# EAGLE design CanarySchematic3.0 (EAGLE 8.4.1)
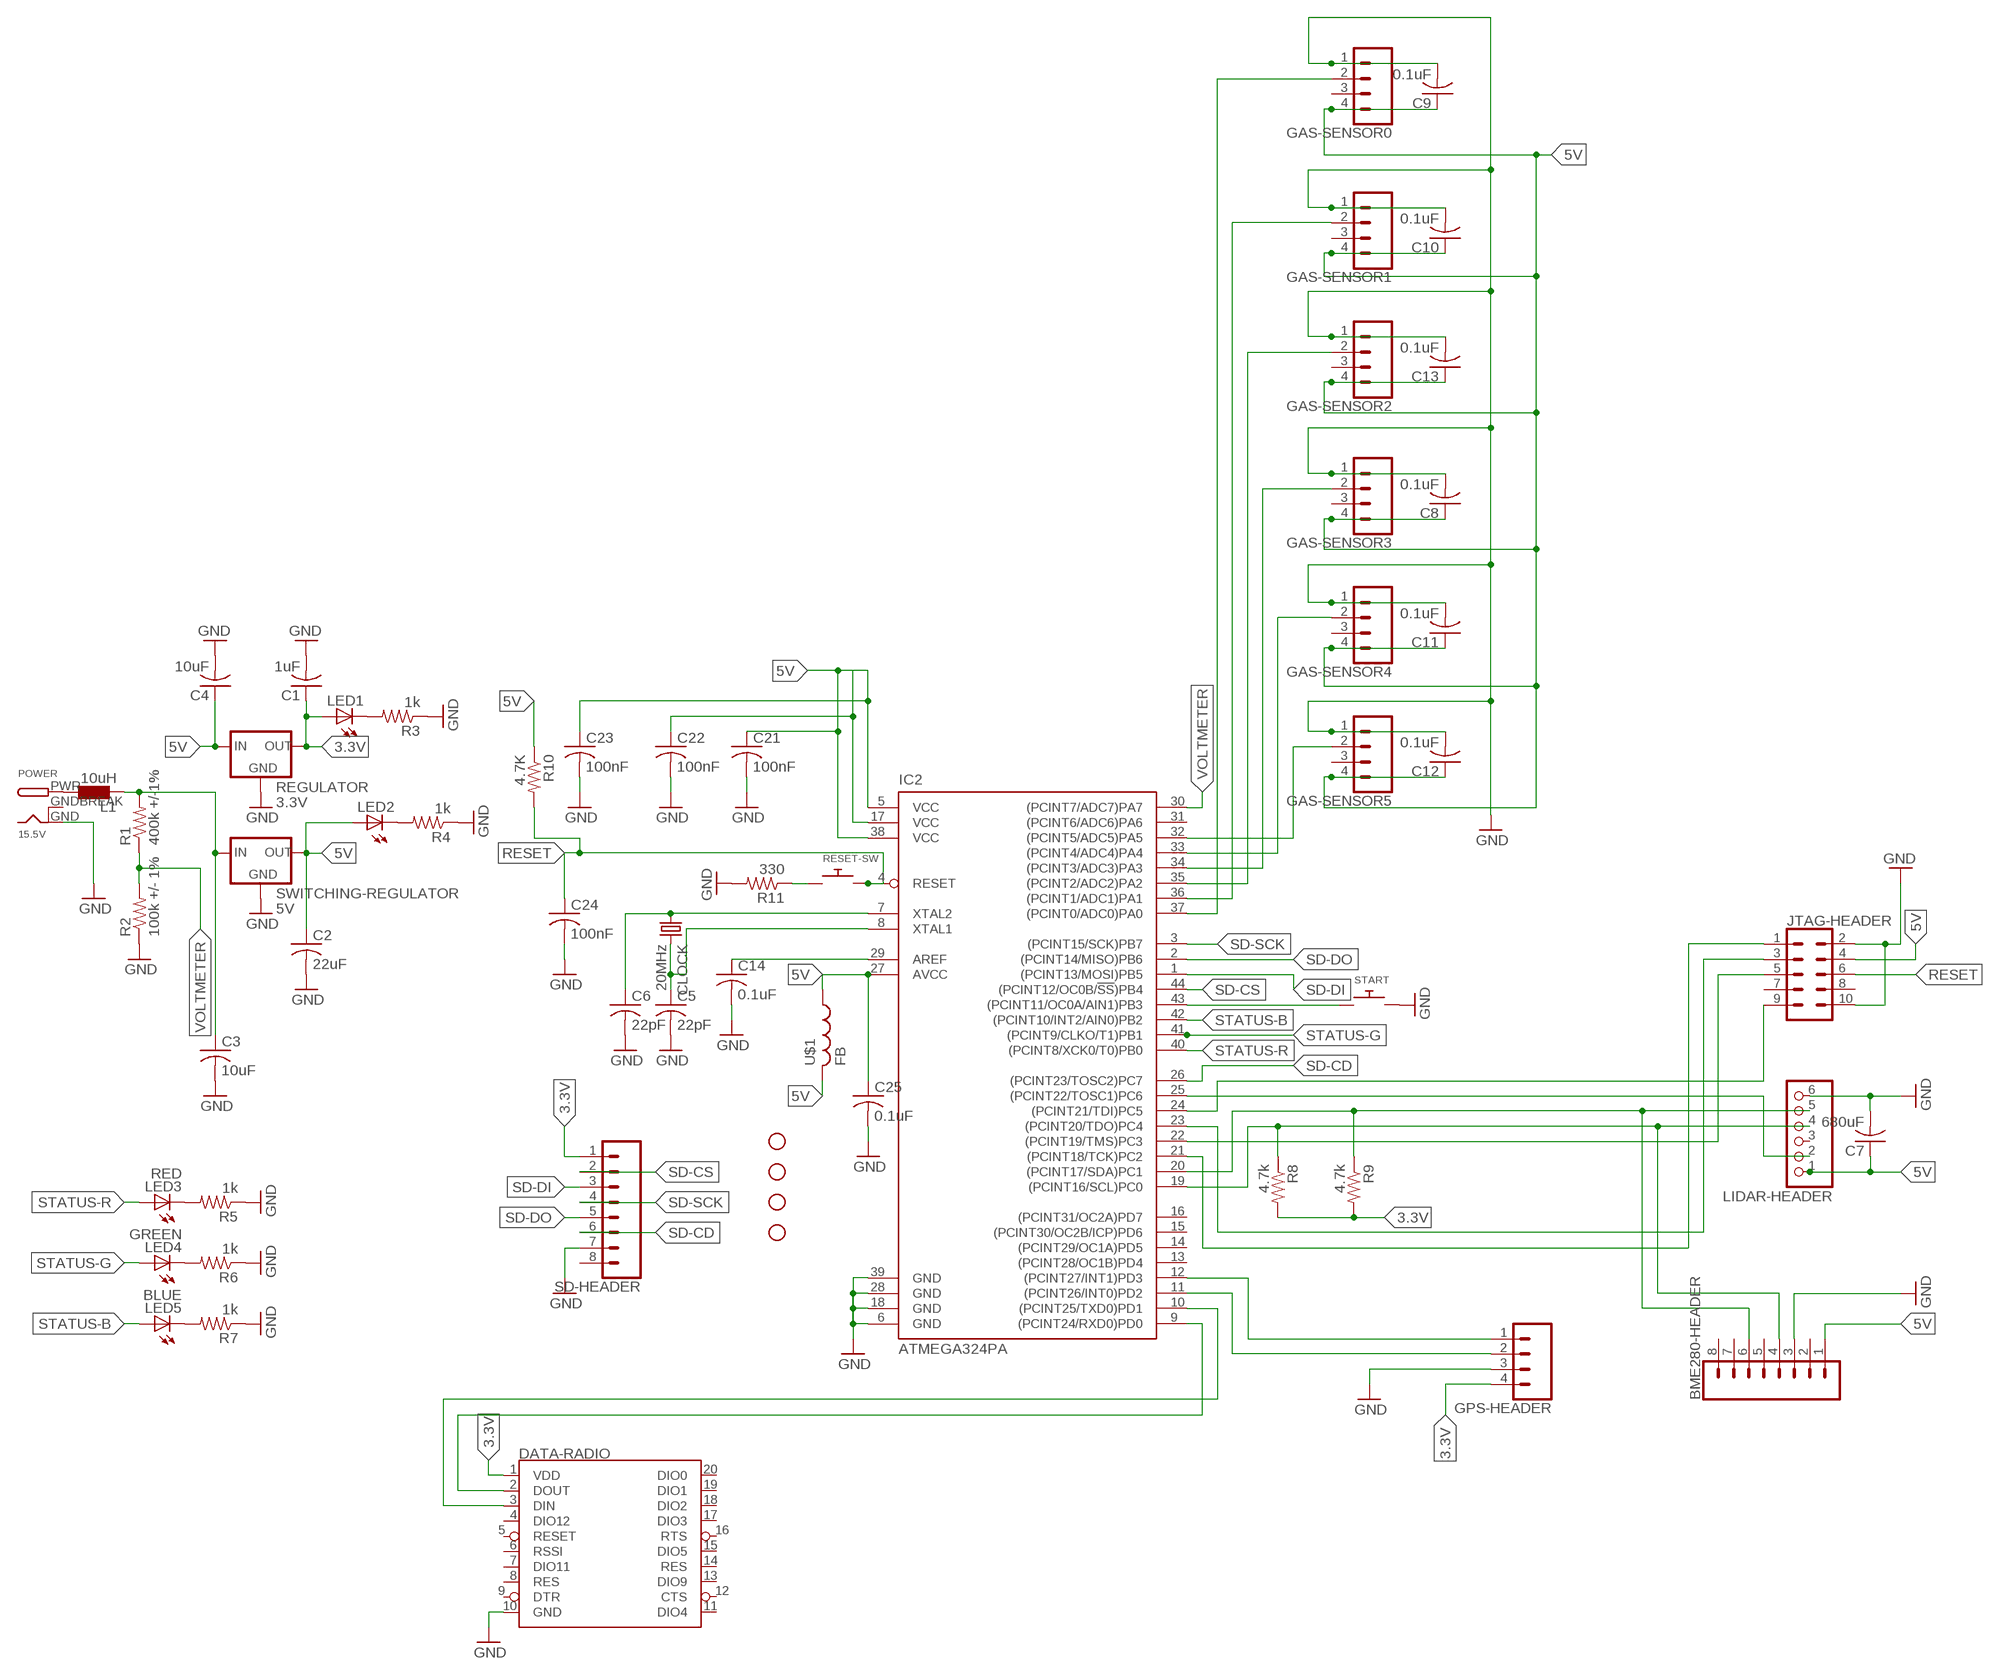
[diagram p0: schematic, sheet 1]

## Parts
BME280-HEADER  CONN_08"  [1X08]
C1  1uF  C-USC0805  [C0805]
C2  22uF  C-USC0805  [C0805]
C3  10uF  C-USC0805  [C0805]
C4  10uF  C-USC0805  [C0805]
C5  22pF  C-USC0805  [C0805]
C6  22pF  C-USC0805  [C0805]
C7  680uF  C-USC0805  [C0805]
C8  0.1uF  C-USC0805  [C0805]
C9  0.1uF  C-USC0805  [C0805]
C10  0.1uF  C-USC0805  [C0805]
C11  0.1uF  C-USC0805  [C0805]
C12  0.1uF  C-USC0603  [C0603]
C13  0.1uF  C-USC0805  [C0805]
C14  0.1uF  C-USC0805  [C0805]
C21  100nF  C-USC0805  [C0805]
C22  100nF  C-USC0805  [C0805]
C23  100nF  C-USC0805  [C0805]
C24  100nF  C-USC0805  [C0805]
C25  0.1uF  C-USC0805  [C0805]
CLOCK  20MHz  CRYSTAL68SMX  [86SMX]
DATA-RADIO  XBEE  [XBEE]
GAS-SENSOR0  CONN_04  [1X04]
GAS-SENSOR1  CONN_04  [1X04]
GAS-SENSOR2  CONN_04  [1X04]
GAS-SENSOR3  CONN_04  [1X04]
GAS-SENSOR4  CONN_04  [1X04]
GAS-SENSOR5  CONN_04  [1X04]
GPS-HEADER  CONN_04  [1X04]
H8  STAND-OFF  [STAND-OFF]
IC2  ATMEGA324PA  ATMEGA644A  [TQFP44]
JTAG-HEADER  CONN_05X2PTH  [2X5]
L1  10uH  L  [L1812]
LED1  LEDCHIP-LED0805  [CHIP-LED0805]
LED2  LEDCHIP-LED0805  [CHIP-LED0805]
LED3  RED  LEDCHIP-LED0805  [CHIP-LED0805]
LED4  GREEN  LEDCHIP-LED0805  [CHIP-LED0805]
LED5  BLUE  LEDCHIP-LED0805  [CHIP-LED0805]
LIDAR-HEADER  PINHD-1X6  [1X06]
MOUNT-HOLE1  STAND-OFF  [STAND-OFF]
MOUNT-HOLE2  STAND-OFF  [STAND-OFF]
MOUNT-HOLE3  STAND-OFF  [STAND-OFF]
POWER  15.5V  DCBARRELPTH  [DCJACK_2MM_PTH]
R1  400k +/-1%  R-US_M0805  [M0805]
R2  100k +/- 1%  R-US_M0805  [M0805]
R3  1k  R-US_M0805  [M0805]
R4  1k  R-US_M0805  [M0805]
R5  1k  R-US_M0805  [M0805]
R6  1k  R-US_M0805  [M0805]
R7  1k  R-US_M0805  [M0805]
R8  4.7k  R-US_M0805  [M0805]
R9  4.7k  R-US_M0805  [M0805]
R10  4.7K  R-US_M0805  [M0805]
R11  330  R-US_M0805  [M0805]
REGULATOR  3.3V  V_REG_78XXSINK  [TO220-IGO]
RESET-SW  SWITCH_PUSHBUTTONSOFTTOUCHSMD_SJ  [PUSHBUTTON_SMD_SJ]
SD-HEADER  CONN_08"  [1X08]
START  SWITCH_PUSHBUTTONSOFTTOUCHSMD_SJ  [PUSHBUTTON_SMD_SJ]
SWITCHING-REGULATOR  5V  V_REG_78XXSINK  [TO220-IGO]
U$1  FB  [FB]

## Nets
3.3V: C1.1 DATA-RADIO.1(VDD) GPS-HEADER.4 LED1.A R8.2 R9.2 REGULATOR.OUT SD-HEADER.1
5V: BME280-HEADER.1 C2.1 C4.1 C7.1 C8.1 C9.1 C10.1 C11.1 C12.1 C13.1 C21.1 C22.1 C23.1 C25.1 GAS-SENSOR0.4 GAS-SENSOR1.4 GAS-SENSOR2.4 GAS-SENSOR3.4 GAS-SENSOR4.4 GAS-SENSOR5.4 IC2.5(VCC) IC2.17(VCC) IC2.27(AVCC) IC2.38(VCC) JTAG-HEADER.4 LED2.A LIDAR-HEADER.1 REGULATOR.IN SWITCHING-REGULATOR.OUT U$1.P$1
GND: BME280-HEADER.3 C1.2 C2.2 C3.2 C4.2 C5.2 C6.2 C7.2 C8.2 C9.2 C10.2 C11.2 C12.2 C13.2 C14.2 C21.2 C22.2 C23.2 C24.2 C25.2 DATA-RADIO.10(GND) GAS-SENSOR0.1 GAS-SENSOR1.1 GAS-SENSOR2.1 GAS-SENSOR3.1 GAS-SENSOR4.1 GAS-SENSOR5.1 GPS-HEADER.3 IC2.6(GND) IC2.18(GND) IC2.28(GND) IC2.39(GND) JTAG-HEADER.2 JTAG-HEADER.10 LIDAR-HEADER.6 POWER.GND R2.1 R3.1 R4.1 R5.1 R6.1 R7.1 R11.2 REGULATOR.GND SD-HEADER.7 START.P$2 SWITCHING-REGULATOR.GND
N$1: C3.1 L1.2 R1.2 SWITCHING-REGULATOR.IN
N$2: LED1.C R3.2
N$3: LED2.C R4.2
N$4: LED3.C R5.2
N$5: LED4.C R6.2
N$6: LED5.C R7.2
N$7: IC2.43((PCINT11/OC0A/AIN1)PB3) START.P$1
N$8: C6.1 CLOCK.1 IC2.7(XTAL2)
N$9: U$1.P$2
N$10: GPS-HEADER.1 IC2.12((PCINT27/INT1)PD3)
N$11: GPS-HEADER.2 IC2.11((PCINT26/INT0)PD2)
N$12: GAS-SENSOR0.2 IC2.37((PCINT0/ADC0)PA0)
N$13: IC2.25((PCINT22/TOSC1)PC6) LIDAR-HEADER.2
N$14: IC2.24((PCINT21/TDI)PC5) JTAG-HEADER.9
N$15: C14.1 IC2.29(AREF)
N$16: GAS-SENSOR1.2 IC2.36((PCINT1/ADC1)PA1)
N$17: GAS-SENSOR2.2 IC2.35((PCINT2/ADC2)PA2)
N$18: GAS-SENSOR3.2 IC2.34((PCINT3/ADC3)PA3)
N$19: GAS-SENSOR4.2 IC2.33((PCINT4/ADC4)PA4)
N$20: GAS-SENSOR5.2 IC2.32((PCINT5/ADC5)PA5)
N$21: BME280-HEADER.4 IC2.19((PCINT16/SCL)PC0) LIDAR-HEADER.4 R8.1
N$22: L1.1 POWER.PWR
N$23: IC2.23((PCINT20/TDO)PC4) JTAG-HEADER.3
N$24: BME280-HEADER.6 IC2.20((PCINT17/SDA)PC1) LIDAR-HEADER.5 R9.1
N$25: IC2.22((PCINT19/TMS)PC3) JTAG-HEADER.5
N$26: DATA-RADIO.3(DIN) IC2.10((PCINT25/TXD0)PD1)
N$27: DATA-RADIO.2(DOUT) IC2.9((PCINT24/RXD0)PD0)
N$28: IC2.21((PCINT18/TCK)PC2) JTAG-HEADER.1
N$30: R11.1 RESET-SW.P$1
N$31: R10.1
N$32: C5.1 CLOCK.4 IC2.8(XTAL1)
RESET: C24.1 IC2.4(RESET) JTAG-HEADER.6 R10.2 RESET-SW.P$2
SD-CD: IC2.26((PCINT23/TOSC2)PC7) SD-HEADER.6
SD-CS: IC2.44((PCINT12/OC0B/!SS!)PB4) SD-HEADER.2
SD-DI: IC2.1((PCINT13/MOSI)PB5) SD-HEADER.3
SD-DO: IC2.2((PCINT14/MISO)PB6) SD-HEADER.5
SD-SCK: IC2.3((PCINT15/SCK)PB7) SD-HEADER.4
STATUS-B: IC2.42((PCINT10/INT2/AIN0)PB2) LED5.A
STATUS-G: IC2.41((PCINT9/CLKO/T1)PB1) LED4.A
STATUS-R: IC2.40((PCINT8/XCK0/T0)PB0) LED3.A
VOLTMETER: IC2.30((PCINT7/ADC7)PA7) R1.1 R2.2
Unconnected: BME280-HEADER.2 BME280-HEADER.5 BME280-HEADER.7 BME280-HEADER.8 DATA-RADIO.4(DIO12) DATA-RADIO.5(RESET) DATA-RADIO.6(RSSI) DATA-RADIO.7(DIO11) DATA-RADIO.8(RES) DATA-RADIO.9(DTR) DATA-RADIO.11(DIO4) DATA-RADIO.12(CTS) DATA-RADIO.13(DIO9) DATA-RADIO.14(RES) DATA-RADIO.15(DIO5) DATA-RADIO.16(RTS) DATA-RADIO.17(DIO3) DATA-RADIO.18(DIO2) DATA-RADIO.19(DIO1) DATA-RADIO.20(DIO0) GAS-SENSOR0.3 GAS-SENSOR1.3 GAS-SENSOR2.3 GAS-SENSOR3.3 GAS-SENSOR4.3 GAS-SENSOR5.3 IC2.13((PCINT28/OC1B)PD4) IC2.14((PCINT29/OC1A)PD5) IC2.15((PCINT30/OC2B/ICP)PD6) IC2.16((PCINT31/OC2A)PD7) IC2.31((PCINT6/ADC6)PA6) JTAG-HEADER.7 JTAG-HEADER.8 LIDAR-HEADER.3 SD-HEADER.8

## Power pins joined to a net without a drawn wire
GNDBREAK: POWER.GNDBREAK

## Library data of the parts
BME280-HEADER SD-HEADER = SparkFun-Connectors:CONN_08: Multi connection point. Often used as Generic Header-pin footprint for 0.1 inch spaced/style header connections On any of the 0.1 inch spaced packages, you can populate with these: Break Away Headers - Straight <https://www.sparkfun.com/products/116> (PRT-00116) Break Away Male Headers - Right Angle <https://www.sparkfun.com/products/553> (PRT-00553) Female Headers <https://www.sparkfun.com/products/115> (PRT-00115) Break Away Headers - Machine Pin <https://www.sparkfun.com/products/117> (PRT-00117) Break Away Female Headers - Swiss Machine Pin <https://www.sparkfun.com/products/743> (PRT-00743) Arduino Stackable Header - 8 Pin <https://www.sparkfun.com/products/9279> (PRT-09279) For SCREWTERMINALS and SPRING TERMINALS visit here: Screw Terimnals on SparkFun.com <https://www.sparkfun.com/search/results?term=Screw+Terminals> (5mm/3.5mm/2.54mm spacing) This device is also useful as a general connection point to wire up your design to another part of your project. Our various solder wires solder well into these plated through hole pads. Hook-Up Wire - Assortment (Stranded, 22 AWG) <https://www.sparkfun.com/products/11375> (PRT-11375) Hook-Up Wire - Assortment (Solid Core, 22 AWG) <https://www.sparkfun.com/products/11367> (PRT-11367) View the entire wire category on our website here <https://www.sparkfun.com/categories/141> Special notes: Molex polarized connector foot print use with SKU : PRT-08231 with associated crimp pins and housings. 1MM SMD Version SKU: PRT-10208 NOTES ON THE VARIANTS LOCK and LOCK_LONGPADS... This footprint was designed to help hold the alignment of a through-hole component (i.e. 6-pin header) while soldering it into place. You may notice that each hole has been shifted either up or down by 0.005 of an inch from it's more standard position (which is a perfectly straight line). This slight alteration caused the pins (the squares in the middle) to touch the edges of the holes. Because they are alternating, it causes a "brace" to hold the component in place. 0.005 has proven to be the perfect amount of "off-center" position when using our standard breakaway headers. Although looks a little odd when you look at the bare footprint, once you have a header in there, the alteration is very hard to notice. Also,if you push a header all the way into place, it is covered up entirely on the bottom side.; PROD_ID: CONN-08438
C1-C14 C21-C25 = adafruit:C-US: CAPACITOR, American symbol
CLOCK = adafruit:CRYSTAL: CRYSTAL; OC_FARNELL: 6344860; OC_NEWARK: unknown
DATA-RADIO = SparkFun-RF:XBEE: Digi XBee and XBee Pro XBees are tiny blue chips that can communicate wirelessly with each other. They can do simple things, like replacing a couple of wires in serial communication, which is nice when you want to make a remote for your paintball vehicle. SparkFun Products SparkFun XBee Buying Guide <https://www.sparkfun.com/pages/xbee_guide> SparkFun XBee Explorer USB <https://www.sparkfun.com/products/11812> (WRL-11812) Breakout Board for XBee Module <https://www.sparkfun.com/products/8276> (WRL-8276) SparkFun XBee Explorer Regulated <https://www.sparkfun.com/products/11373> (WRL-11373) SparkFun XBee Explorer Dongle <https://www.sparkfun.com/products/11697> (WRL-11697) SparkFun XBee Shield <https://www.sparkfun.com/products/12847> (WRL-12847) SparkFun XBee Explorer Serial <https://www.sparkfun.com/products/13225> (WRL-13225)
GAS-SENSOR0 GAS-SENSOR1-GAS-SENSOR5 GPS-HEADER = SparkFun-Connectors:CONN_04: Multi connection point. Often used as Generic Header-pin footprint for 0.1 inch spaced/style header connections On any of the 0.1 inch spaced packages, you can populate with these: Break Away Headers - Straight <https://www.sparkfun.com/products/116> (PRT-00116) Break Away Male Headers - Right Angle <https://www.sparkfun.com/products/553> (PRT-00553) Female Headers <https://www.sparkfun.com/products/115> (PRT-00115) Break Away Headers - Machine Pin <https://www.sparkfun.com/products/117> (PRT-00117) Break Away Female Headers - Swiss Machine Pin <https://www.sparkfun.com/products/743> (PRT-00743) For SCREWTERMINALS and SPRING TERMINALS visit here: Screw Terimnals on SparkFun.com <https://www.sparkfun.com/search/results?term=Screw+Terminals> (5mm/3.5mm/2.54mm spacing) This device is also useful as a general connection point to wire up your design to another part of your project. Our various solder wires solder well into these plated through hole pads. Hook-Up Wire - Assortment (Stranded, 22 AWG) <https://www.sparkfun.com/products/11375> (PRT-11375) Hook-Up Wire - Assortment (Solid Core, 22 AWG) <https://www.sparkfun.com/products/11367> (PRT-11367) View the entire wire category on our website here <https://www.sparkfun.com/categories/141> Special notes: Molex polarized connector foot print use with SKU : PRT-08231 with associated crimp pins and housings. 1MM SMD Version SKU: PRT-10208; PROD_ID: CONN-09696
H8 MOUNT-HOLE1-MOUNT-HOLE3 = SparkFun-Hardware:STAND-OFF: Stand Off Drill holes for mechanically mounting via screws, standoffs, etc. Note: Use the keepout ring to avoid running the screw head into surrounding components. Variant Overviews STAND-OFF - Mechanical footprint for a #4 phillips button head screw. STAND-OFF-TIGHT - Mechanical footprint for a #4 phillips button head screw, Example SparkFun Products Screw - Phillips Head (1/4", 4-40, 10 pack) <https://www.sparkfun.com/products/10453> (PRT-10453) Screw - Phillips Head (1/2", 4-40, 10 pack) <https://www.sparkfun.com/products/10452> (PRT-10452) Screw - Phillips Head (3/4", 4-40, 10 pack) <https://www.sparkfun.com/products/10451> (PRT-10451) Screw - Phillips Head (1", 4-40, 10 pack) <https://www.sparkfun.com/products/10450> (PRT-10450)
IC2 = atmel:ATMEGA644: 8-bit Microcontroller with 64K Bytes In-System Programmable Flash Source: http://www.atmel.com/dyn/resources/prod_documents/doc2593.pdf; MPN: ATMEGA644PV-10AU; OC_FARNELL: 1455123; OC_NEWARK: 58M3748
JTAG-HEADER = SparkFun-Connectors:CONN_05X2: Multi connection point. Often used as Generic Header-pin footprint for 0.1 inch spaced/style header connections For AVR SPI programming port, see special device with nice symbol: "AVR_SPI_PROG_5x2.dev" You can populate with any combo of single row headers, but if you'd like an exact match, check these: 2x5 AVR ICSP Male Header <https://www.sparkfun.com/products/778> (PRT-00778) 2x5 Pin Shrouded Header <https://www.sparkfun.com/products/8506> (PRT-08506) On any of the 0.1 inch spaced packages, you can populate with these: Break Away Headers - Straight <https://www.sparkfun.com/products/116> (PRT-00116) Break Away Male Headers - Right Angle <https://www.sparkfun.com/products/553> (PRT-00553) Female Headers <https://www.sparkfun.com/products/115> (PRT-00115) Break Away Headers - Machine Pin <https://www.sparkfun.com/products/117> (PRT-00117) Break Away Female Headers - Swiss Machine Pin <https://www.sparkfun.com/products/743> (PRT-00743) Special note: the shrouded connector mates well with our 5x2 ribbon cables: 2x5 Pin IDC Ribbon Cable <https://www.sparkfun.com/products/8535> (PRT-08535); PROD_ID: CONN-08499; SF_ID: PRT-0778
L1 = eagle-ltspice:L: INDUCTOR, European symbol; SPICEMODEL: NONE; SPICEPREFIX: L
LED1-LED5 = adafruit:LED: LED OSRAM: - CHIPLED LG R971, LG N971, LY N971, LG Q971, LY Q971, LO R971, LY R971 LH N974, LH R974 LS Q976, LO Q976, LY Q976 LO Q996 - Hyper CHIPLED LW Q18S LB Q993, LB Q99A, LB R99A - SideLED LS A670, LO A670, LY A670, LG A670, LP A670 LB A673, LV A673, LT A673, LW A673 LH A674 LY A675 LS A676, LA A676, LO A676, LY A676, LW A676 LS A679, LY A679, LG A679 - Hyper Micro SIDELED® LS Y876, LA Y876, LO Y876, LY Y876 LT Y87S - SmartLED LW L88C, LW L88S LB L89C, LB L89S, LG L890 LS L89K, LO L89K, LY L89K LS L896, LA L896, LO L896, LY L896 - TOPLED LS T670, LO T670, LY T670, LG T670, LP T670 LSG T670, LSP T670, LSY T670, LOP T670, LYG T670 LG T671, LOG T671, LSG T671 LB T673, LV T673, LT T673, LW T673 LH T674 LS T676, LA T676, LO T676, LY T676, LB T676, LH T676, LSB T676, LW T676 LB T67C, LV T67C, LT T67C, LS T67K, LO T67K, LY T67K, LW E67C LS E67B, LA E67B, LO E67B, LY E67B, LB E67C, LV E67C, LT E67C LW T67C LS T679, LY T679, LG T679 LS T770, LO T770, LY T770, LG T770, LP T770 LB T773, LV T773, LT T773, LW T773 LH T774 LS E675, LA E675, LY E675, LS T675 LS T776, LA T776, LO T776, LY T776, LB T776 LHGB T686 LT T68C, LB T68C - Hyper Mini TOPLED® LB M676 - Mini TOPLED Santana® LG M470 LS M47K, LO M47K, LY M47K Source: http://www.osram.convergy.de/
LIDAR-HEADER = adafruit:PINHD-1X6: PIN HEADER
POWER = adafruit:DCBARREL: 2.0mm DC Barrel Jack DCJACK_2MM_PTH - Through Hole Jack (4UConnector: 05537)
R1-R11 = adafruit:R-US_: RESISTOR, American symbol
REGULATOR SWITCHING-REGULATOR = SparkFun-IC-Power:V_REG_78XX: Voltage Regulator Standard 78xx regulator. IGO (Input Ground Output). Spark Fun Electronics SKU : COM-00107
RESET-SW START = adafruit:SWITCH_PUSHBUTTON: Buttons SOFTTOUCHSMD_SJ - Soft touch temporary push button (Super Junk Akihabara) Compatible with SKPMANE010 [Mouser: 688-SKPMAN] C&K_KSS = Digikey: KSS221GLFS
U$1 = adafruit:FB: Ferrite bead Digikey #P9821BK-ND

## Board
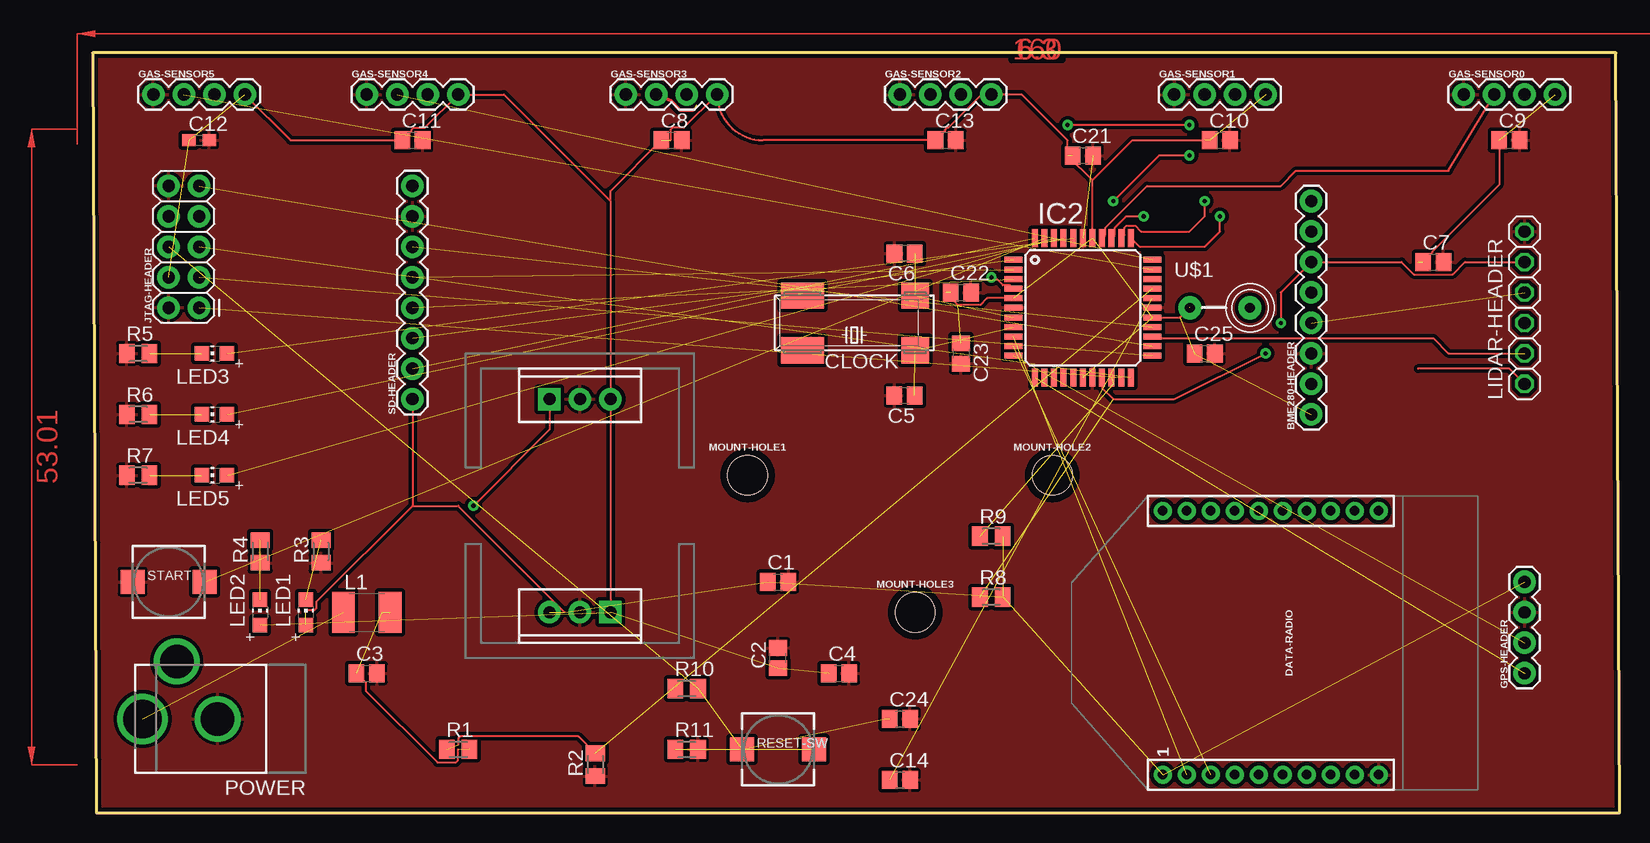
[diagram p1: board, top side]
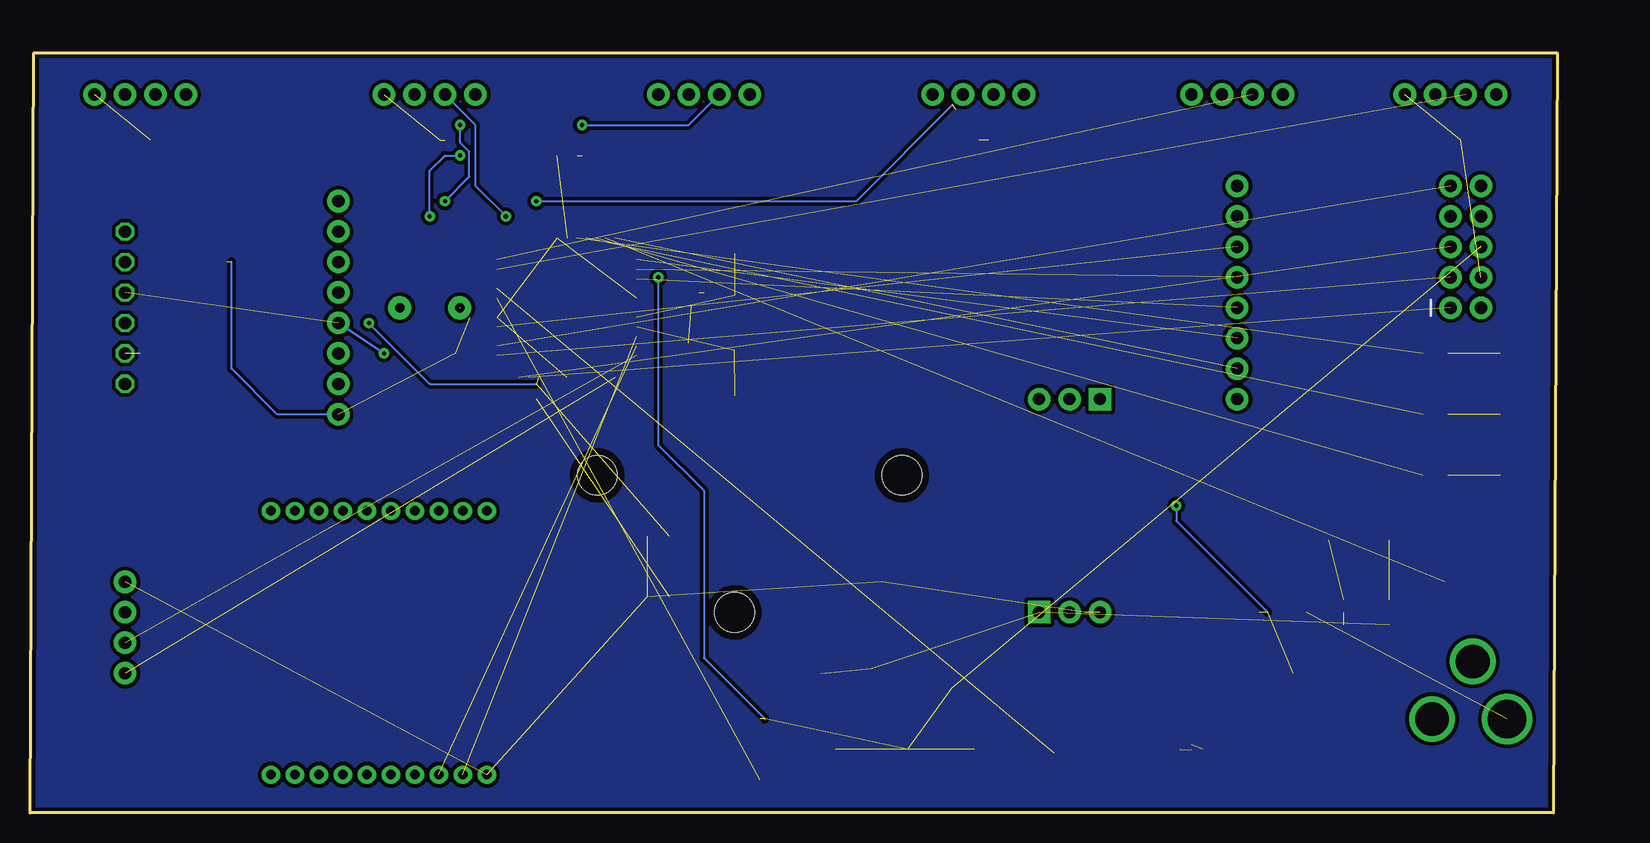
[diagram p2: board, bottom side, seen from below]

Size 127.3 x 63.39 mm. Coordinates in mm from the lower left corner, seen from the top.
Outline: 0.32,0 127.3,0 126.98,63.39 0,63.39 0.32,0
Copper layers (1*16): Top 0.035mm / dielectric 1.5mm / Bottom 0.035mm
Design rules "SparkFun-2-layer-STANDARD": minimum track width 10mil, minimum drill 20mil, track to track 10mil, track to pad 8mil, pad to pad 8mil, via to via 10mil, smd to smd 8mil, copper to edge 8mil, drill to drill 8mil, minimum pad ring 10mil, minimum via ring 10mil, stop-mask expansion 4mil, vias tented up to drill 25mil, thermal gap 10mil

### Footprints (pad centres in the part's own frame; a part is rotated, then mirrored left to right if it is on the bottom)
1X08 = drill 1.016 pad 1.88: 1 0,0; 2 2.54,0; 3 5.08,0; 4 7.62,0; 5 10.16,0; 6 12.7,0; 7 15.24,0; 8 17.78,0
C0805 = smd 1.3 x 1.5: 1 -0.85,0; 2 0.85,0
C0603 = smd 1.1 x 1: 1 -0.85,0; 2 0.85,0
86SMX = smd 2.286 x 2.184: 1 -5.08,-2.286; 4 -5.08,2.286 | smd 3.556 x 2.184: 2 4.318,-2.286; 3 4.318,2.286
XBEE = drill 0.8 pad 1.524: 1 -11,20; 2 -11,18; 3 -11,16; 4 -11,14; 5 -11,12; 6 -11,10; 7 -11,8; 8 -11,6; 9 -11,4; 10 -11,2; 11 11,2; 12 11,4; 13 11,6; 14 11,8; 15 11,10; 16 11,12; 17 11,14; 18 11,16; 19 11,18; 20 11,20
1X04 = drill 1.016 pad 1.88: 1 0,0; 2 2.54,0; 3 5.08,0; 4 7.62,0
STAND-OFF = hole 3.302: 0,0
TQFP44 = smd 1.5 x 0.5: 1 -5.8,4; 2 -5.8,3.2; 3 -5.8,2.4; 4 -5.8,1.6; 5 -5.8,0.8; 6 -5.8,0; 7 -5.8,-0.8; 8 -5.8,-1.6; 9 -5.8,-2.4; 10 -5.8,-3.2; 11 -5.8,-4; 23 5.8,-4; 24 5.8,-3.2; 25 5.8,-2.4; 26 5.8,-1.6; 27 5.8,-0.8; 28 5.8,0; 29 5.8,0.8; 30 5.8,1.6; 31 5.8,2.4; 32 5.8,3.2; 33 5.8,4 | smd 0.5 x 1.5: 12 -4,-5.8; 13 -3.2,-5.8; 14 -2.4,-5.8; 15 -1.6,-5.8; 16 -0.8,-5.8; 17 0,-5.8; 18 0.8,-5.8; 19 1.6,-5.8; 20 2.4,-5.8; 21 3.2,-5.8; 22 4,-5.8; 34 4,5.8; 35 3.2,5.8; 36 2.4,5.8; 37 1.6,5.8; 38 0.8,5.8; 39 0,5.8; 40 -0.8,5.8; 41 -1.6,5.8; 42 -2.4,5.8; 43 -3.2,5.8; 44 -4,5.8
2X5 = drill 1.016 pad 1.88: 1 0,0; 2 0,2.54; 3 2.54,0; 4 2.54,2.54; 5 5.08,0; 6 5.08,2.54; 7 7.62,0; 8 7.62,2.54; 9 10.16,0; 10 10.16,2.54
L1812 = smd 1.9 x 3.4: 1 -1.95,0; 2 1.95,0
CHIP-LED0805 = smd 1.2 x 1.2: A 0,-1.05; C 0,1.05
1X06 = drill 1.016 octagon: 1 -6.35,0; 2 -3.81,0; 3 -1.27,0; 4 1.27,0; 5 3.81,0; 6 6.35,0
DCJACK_2MM_PTH = drill 2.8: GND 0,7.35; GNDBREAK 4.8,10.75 | drill 3.2: PWR 0,13.6
M0805 = smd 1.3 x 1.6: 1 -0.95,0; 2 0.95,0
TO220-IGO = drill 1 pad 1.88: GND 0,0; OUT 2.54,0 | drill 1 pad 1.88 square: IN -2.54,0
PUSHBUTTON_SMD_SJ = smd 2 x 2: P$1 3,0; P$2 -3,0
FB = drill 0.8 pad 1.93: P$1 -2.5,0; P$2 2.5,0

### Placement (x,y rotation side)
BME280-HEADER  101.6,33.24 90 top
C1  57.15,19.27 0 top
C2  57.15,12.92 90 top
C3  22.86,11.65 0 top
C4  62.23,11.65 0 top
C5  67.69,34.79 180 top
C6  67.7,46.66 180 top
C7  111.76,45.94 0 top
C8  48.26,56.1 0 top
C9  118.11,56.1 0 top
C10  93.98,56.1 0 top
C11  26.67,56.1 0 top
C12  8.89,56.1 0 top
C13  71.12,56.1 0 top
C14  67.31,2.76 0 top
C21  82.55,54.83 0 top
C22  72.39,43.4 0 top
C23  72.39,38.32 270 top
C24  67.31,7.84 0 top
C25  92.71,38.32 0 top
CLOCK  63.5,40.86 180 top
DATA-RADIO  109.22,14.19 90 top
GAS-SENSOR0  114.3,59.91 0 top
GAS-SENSOR1  90.17,59.91 0 top
GAS-SENSOR2  67.31,59.91 0 top
GAS-SENSOR3  44.45,59.91 0 top
GAS-SENSOR4  22.86,59.91 0 top
GAS-SENSOR5  5.08,59.91 0 top
GPS-HEADER  119.38,11.65 90 top
H8  -68.58,59.91 0 top  (outside the outline)
IC2  82.55,42.13 0 top
JTAG-HEADER  8.89,42.13 90 top
L1  22.86,16.73 0 top
LED1  17.78,16.73 0 top
LED2  13.97,16.73 0 top
LED3  10.16,38.32 90 top
LED4  10.16,33.24 90 top
LED5  10.16,28.16 90 top
LIDAR-HEADER  119.38,42.13 90 top
MOUNT-HOLE1  54.61,28.16 0 top
MOUNT-HOLE2  80.01,28.16 0 top
MOUNT-HOLE3  68.58,16.73 0 top
POWER  17.78,7.84 90 top
R1  30.48,5.3 0 top
R2  41.91,4.03 90 top
R3  19.05,21.81 90 top
R4  13.97,21.81 90 top
R5  3.81,38.32 0 top
R6  3.81,33.24 0 top
R7  3.81,28.16 0 top
R8  74.93,18 0 top
R9  74.93,23.08 0 top
R10  49.53,10.38 0 top
R11  49.53,5.3 0 top
REGULATOR  40.64,16.73 180 top
RESET-SW  57.15,5.3 0 top
SD-HEADER  26.67,34.51 90 top
START  6.35,19.27 0 top
SWITCHING-REGULATOR  40.64,34.51 0 top
U$1  93.98,42.13 0 top

### Tracks (layer width: path | path; a pad name or v marks a point on that pad's centre or on a via)
3.3V  (7 unrouted)
  Top 0.152: SD-HEADER.1 26.67,25.62 | 26.67,25.62 18.66,17.61 18.66,17.06 18.5,16.9 17.95,16.9 17.78,16.73 | 26.67,25.62 30.48,25.62 39.37,16.73
5V  (20 unrouted)
  Top 0.152: IC2.38 83.35,52.76 | 83.35,52.76 81.28,54.83 81.28,56.1 77.47,59.91 GAS-SENSOR2.4 74.11,59.91 71.33,57.13 71.2,57.13 71.04,56.96 71.04,56.87 C13.1 55.88,56.1 arc-90 GAS-SENSOR3.4 49.29,57.13 48.34,57.13 48.18,56.96 48.18,56.1 | 92.71,56.1 86.69,56.1 83.35,52.76 | IC2.27 90.64,41.33 91.44,42.13 | IC2.5 74.56,42.93 74.01,42.37 72.15,42.37 71.12,43.4 | C8.1 43.18,51.87 43.18,51.02 | 43.18,51.02 SWITCHING-REGULATOR.OUT REGULATOR.IN | LIDAR-HEADER.1 118.11,37.05 110.49,37.05 | C7.1 111.68,46.71 111.68,46.8 117.26,52.38 C9.1 | GAS-SENSOR5.4 16.51,56.1 C11.1 26.59,56.87 26.59,56.96 26.75,57.13 27.7,57.13 GAS-SENSOR4.4 34.29,59.91 43.18,51.02
  Bottom 0.152: BME280-HEADER.1 106.68,33.24 110.49,37.05 110.49,45.94
GND  (1 unrouted)
  pour Top (isolate 0.305): 0,0.22 0,63.72 10.16,63.72 127,63.72 127,42.13 127,0.22
N$1  (via drill 0.35)  (3 unrouted)
  Top 0.152: SWITCHING-REGULATOR.IN 38.1,31.97 v31.75,25.62 | C3.1 22.78,10.88 22.78,10.2 28.76,4.22 30.3,4.22 30.46,4.38 30.46,5.28 30.48,5.3
  Bottom 0.152: v31.75,25.62 31.75,24.35 24.13,16.73
N$2  (1 unrouted)
N$3  (1 unrouted)
N$4  (1 unrouted)
N$5  (1 unrouted)
N$6  (1 unrouted)
N$7  (1 unrouted)
N$8  (2 unrouted)
N$10  (1 unrouted)
N$11  (1 unrouted)
N$12
  Top 0.152: IC2.37 84.42,48.2 84.42,48.79 87.92,52.29 99.06,52.29 100.33,53.56 113.03,53.56 GAS-SENSOR0.2
N$13  (1 unrouted)
  Top 0.152: IC2.25 88.49,39.59 111.76,39.59 113.03,38.32 118.11,38.32
N$14  (1 unrouted)
N$15  (1 unrouted)
N$16  (via drill 0.35)
  Top 0.152: IC2.36 85.22,48.2 85.22,48.79 86.17,49.75 v87.63,49.75
  Bottom 0.152: v87.63,49.75 90.17,52.29 90.17,57.37 GAS-SENSOR1.2
N$17  (via drill 0.35)
  Top 0.152: IC2.35 86.02,48.2 86.02,48.79 86.18,48.96 86.92,48.96 87.4,48.48 91.44,48.48 92.71,49.75 v92.71,51.02 | v91.44,57.37 v81.28,57.37
  Bottom 0.152: v91.44,57.37 91.44,55.9 90.68,55.14 90.68,53.05 v92.71,51.02 | v81.28,57.37 72.39,57.37 GAS-SENSOR2.2
N$18  (via drill 0.35)  (1 unrouted)
  Top 0.152: IC2.34 87.27,47.21 92.71,47.21 93.98,48.48 v93.98,49.75 | v91.44,54.83 88.9,54.83 v85.09,51.02
  Top 0.305: 50.11,58.66 50.07,58.61 48.99,58.61 48.23,59.37 48.23,59.41 GAS-SENSOR3.2
  Bottom 0.152: v93.98,49.75 93.98,53.56 92.71,54.83 v91.44,54.83 | v85.09,51.02 58.42,51.02 50.39,59.04
N$19  (1 unrouted)
N$20  (1 unrouted)
N$21  (via drill 0.35)  (2 unrouted)
  Top 0.152: IC2.19 84.15,35.45 85.09,34.51 90.17,34.51 v97.79,38.32
  Bottom 0.152: v97.79,38.32 BME280-HEADER.4
N$22  (1 unrouted)
N$23  (1 unrouted)
N$24  (via drill 0.35)  (2 unrouted)
  Top 0.152: v99.06,40.86 99.06,43.4 BME280-HEADER.6 109.12,45.94 110.14,44.91 113.38,44.91 114.41,45.94 LIDAR-HEADER.5
  Bottom 0.152: v99.06,40.86 93.98,35.78 85.09,35.78
N$25  (1 unrouted)
N$26  (1 unrouted)
N$27  (1 unrouted)
N$28  (1 unrouted)
N$30  (1 unrouted)
N$32  (2 unrouted)
N$33
  pour Bottom (isolate 0.305): 0,0.22 127,0.22 127,63.72 0,63.72
RESET  (via drill 0.35)  (4 unrouted)
  Top 0.152: IC2.4 76.48,44 75.88,44 75.22,44.67 v74.93,44.67
  Bottom 0.152: v74.93,44.67 74.93,30.7 71.12,26.89 71.12,12.92 66.04,7.84
SD-CD  (1 unrouted)
SD-CS  (1 unrouted)
SD-DI  (1 unrouted)
SD-DO  (1 unrouted)
SD-SCK  (1 unrouted)
STATUS-B  (1 unrouted)
STATUS-G  (1 unrouted)
STATUS-R  (1 unrouted)
VOLTMETER  (2 unrouted)
  Top 0.152: 30.48,5.7 30.5,5.72 30.5,6.21 30.66,6.38 40.51,6.38 R2.2
(copper drawn outside any net)
  shapes: Top area x5